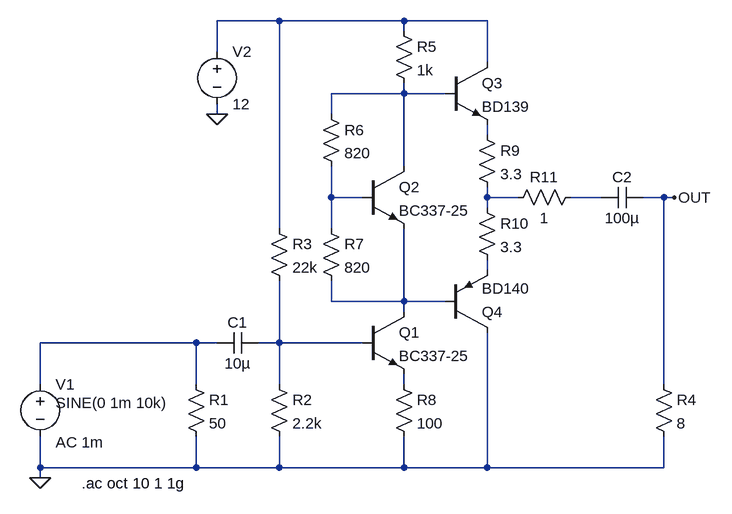
[diagram p0: schematic PushPull.asc]
PushPull.asc, the LTspice schematic file:
Version 4
SHEET 1 1196 680
WIRE 448 -368 352 -368
WIRE 640 -368 448 -368
WIRE 768 -368 640 -368
WIRE 640 -352 640 -368
WIRE 352 -320 352 -368
WIRE 768 -304 768 -368
WIRE 640 -256 640 -272
WIRE 640 -256 528 -256
WIRE 704 -256 640 -256
WIRE 352 -224 352 -240
WIRE 528 -224 528 -256
WIRE 768 -192 768 -208
WIRE 640 -144 640 -256
WIRE 528 -96 528 -144
WIRE 576 -96 528 -96
WIRE 768 -96 768 -112
WIRE 816 -96 768 -96
WIRE 944 -96 896 -96
WIRE 1040 -96 1008 -96
WIRE 1056 -96 1040 -96
WIRE 768 -80 768 -96
WIRE 448 -48 448 -368
WIRE 528 -48 528 -96
WIRE 768 16 768 0
WIRE 528 64 528 32
WIRE 640 64 640 -48
WIRE 640 64 528 64
WIRE 704 64 640 64
WIRE 640 80 640 64
WIRE 320 128 80 128
WIRE 352 128 320 128
WIRE 448 128 448 32
WIRE 448 128 416 128
WIRE 576 128 448 128
WIRE 80 192 80 128
WIRE 320 192 320 128
WIRE 448 192 448 128
WIRE 640 192 640 176
WIRE 1040 192 1040 -96
WIRE 80 320 80 272
WIRE 320 320 320 272
WIRE 320 320 80 320
WIRE 448 320 448 272
WIRE 448 320 320 320
WIRE 640 320 640 272
WIRE 640 320 448 320
WIRE 768 320 768 112
WIRE 768 320 640 320
WIRE 1040 320 1040 272
WIRE 1040 320 768 320
WIRE 80 336 80 320
FLAG 80 336 0
FLAG 352 -224 0
FLAG 1056 -96 OUT
SYMBOL cap 416 112 R90
WINDOW 0 0 32 VBottom 2
WINDOW 3 32 32 VTop 2
SYMATTR InstName C1
SYMATTR Value 10µ
SYMBOL cap 1008 -112 R90
WINDOW 0 0 32 VBottom 2
WINDOW 3 32 32 VTop 2
SYMATTR InstName C2
SYMATTR Value 100µ
SYMBOL res 304 176 R0
SYMATTR InstName R1
SYMATTR Value 50
SYMBOL res 432 176 R0
SYMATTR InstName R2
SYMATTR Value 2.2k
SYMBOL res 432 -64 R0
SYMATTR InstName R3
SYMATTR Value 22k
SYMBOL res 1024 176 R0
SYMATTR InstName R4
SYMATTR Value 8
SYMBOL res 624 -368 R0
SYMATTR InstName R5
SYMATTR Value 1k
SYMBOL res 512 -240 R0
SYMATTR InstName R6
SYMATTR Value 820
SYMBOL res 512 -64 R0
SYMATTR InstName R7
SYMATTR Value 820
SYMBOL res 624 176 R0
SYMATTR InstName R8
SYMATTR Value 100
SYMBOL npn 576 80 R0
SYMATTR InstName Q1
SYMATTR Value BC337-25
SYMBOL npn 576 -144 R0
SYMATTR InstName Q2
SYMATTR Value BC337-25
SYMBOL npn 704 -304 R0
SYMATTR InstName Q3
SYMATTR Value BD139
SYMBOL pnp 704 112 M180
SYMATTR InstName Q4
SYMATTR Value BD140
SYMBOL res 752 -208 R0
SYMATTR InstName R9
SYMATTR Value 3.3
SYMBOL res 752 -96 R0
SYMATTR InstName R10
SYMATTR Value 3.3
SYMBOL res 912 -112 R90
WINDOW 0 0 56 VBottom 2
WINDOW 3 32 56 VTop 2
SYMATTR InstName R11
SYMATTR Value 1
SYMBOL voltage 80 176 R0
WINDOW 123 24 105 Left 2
WINDOW 39 0 0 Left 2
WINDOW 3 24 44 Left 2
SYMATTR Value2 AC 1m
SYMATTR InstName V1
SYMATTR Value SINE(0 1m 10k)
SYMBOL voltage 352 -336 R0
WINDOW 123 0 0 Left 2
WINDOW 39 0 0 Left 2
SYMATTR InstName V2
SYMATTR Value 12
TEXT 144 344 Left 2 !.ac oct 10 1 1g

The netlist it stands for:
* PushPull.asc
C1 N010 N009 10µ
C2 OUT N006 100µ
R1 N009 0 50
R2 N010 0 2.2k
R3 N001 N010 22k
R4 OUT 0 8
R5 N001 N002 1k
R6 N002 N004 820
R7 N004 N008 820
R8 N011 0 100
Q1 N008 N010 N011 0 BC337-25
Q2 N002 N004 N008 0 BC337-25
Q3 N001 N002 N003 0 BD139
Q4 0 N008 N007 0 BD140
R9 N003 N005 3.3
R10 N005 N007 3.3
R11 N006 N005 1
V1 N009 0 SINE(0 1m 10k) AC 1m
V2 N001 0 12
.model NPN NPN
.model PNP PNP
.lib standard.bjt
.ac oct 10 1 1g
.backanno
.end